# Altium project IMU V1.PrjPcb (part 2 of 2)

## Sheet GPS Connector - LS20031.SchDoc
size A4; Organization: Altium Limited; Address1: 3 Minna Close; Address2: Belrose; Address3: NSW 2085; Address4: Australia
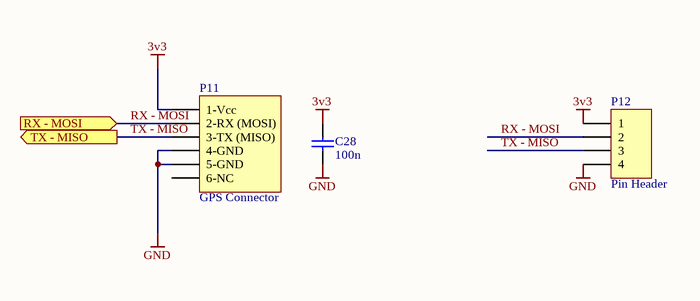
[diagram p13: GPS Connector - LS20031.SchDoc]

### Parts
C28  100n  [C0805]
P11  GPS Connector  [GPScon-BM06B-SRSS-TB]
P12  Pin Header  [PH1x4_2.54]

### Ports
RX - MOSI (in), TX - MISO (out)

### Nets
3v3: C28.2 P11.A1(1-Vcc) P12.1
GND: C28.1 P11.0 P11.A4(4-GND) P11.A5(5-GND) P12.4
RX - MOSI: P11.A2(2-RX_(MOSI)) P12.2 ; port RX - MOSI  [project net GPS - MOSI]
TX - MISO: P11.A3(3-TX_(MISO)) P12.3 ; port TX - MISO  [project net GPS - MISO]

Not connected (* = marked no-connect by the designer): P11 A6(6-NC)

### Notes on the sheet
- Title
- Size:
- Date:
- A4
- Name:
- Time:
- Ing. W. Pietersz
- Revision:
- Sheet
- of
- WillyPietersz@gmail.com
- Contact:
- -
- www.wnpd.nl
- Disclaimer
  Any design and information, hardware or software  is provided on an "as-is" basis without warranty of any kind and any express or implied warranties, including, but not limited to, the implied warranties of merchantability and fitness for a particular purpose are disclaimed. In no event shall wnpd (or KeaDrone)be liable for any direct, indirect, incidental, special, exemplary, or consequential damages (including, but not limited to, procurement of substitute goods or services; loss of use, data, or profits; or business interruption) however caused and on any theory of liability, whether in contract, strict liability, or tort (including negligence or otherwise) arising in any way out of the use of this firmware, hardware, software or information, even if wnpd (or KeaDrone) has been advised by user of the possibility of such potential loss or damage. The user agrees to hold wnpd (or KeaDrone) harmless from and against any and all claims, losses, liabilities and expenses.
- File:

### Library data of the parts
C28 = 100n: Tolerance: 0.1; LatestRevision Note: Initial Release; Part Number: 100n; Value: 100n; Package: 0805; Component Type: Standard; LatestRevision Date: 31-7-2010; Author: Willy Pietersz; Supplier 2: Farnell; Supplier Part Number 2: 1759266; ComponentLink1Description: Manufacturer; ComponentLink2Description: Datasheet
P11 = GPS-LS20031: Header, 6-Pin; GPS; 1mm pitch; SMT; SH connector; Crimp; LatestRevisionDate: 17-Jul-2002; LatestRevisionNote: Re-released for DXP Platform.; Publisher: Altium Limited; Part Number: GPS-LS20031; Number Of Pins: 6
P12 = PH1x4: Con1x4; Part Number: PH1x4; Pitch: 2.54; LatestRevision Note: Initial Release; Type: Pin Header; Number Of Pins: 4; Component Type: Standard; LatestRevision Date: 23-11-2010; Author: Willy Pietersz; Supplier 2: Farnell

## Sheet Sensor current 100A.SchDoc
size A4; Organization: Altium Limited; Address1: 3 Minna Close; Address2: Belrose; Address3: NSW 2085; Address4: Australia
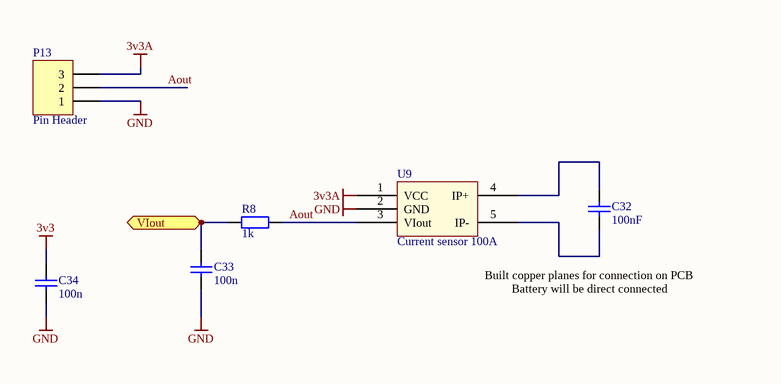
[diagram p14: Sensor current 100A.SchDoc]

### Parts
C32  100nF  [C1206]
C33  100n  [C0805]
C34  100n  [C0805]
P13  Pin Header  [PH1x3_2.54]
R8  value 1k  [R0805]  (hidden comment: RESISTOR)
U9  Current sensor 100A  [unique-ACS758xCB]

### Ports
VIout (out)

### Nets
3v3: C34.2
3v3A: P13.3 U9.1(VCC)
GND: C33.1 C34.1 P13.1 U9.2(GND)
Aout: P13.2 R8.1 U9.3(VIout)
NetC32_1: C32.1 U9.5(IP-)
NetC32_2: C32.2 U9.4(IP+)
NetC33_2: C33.2 R8.2 ; port VIout

### Notes on the sheet
- Built copper planes for connection on PCB
- Battery will be direct connected
- Title
- Size:
- Date:
- A4
- Name:
- Time:
- Ing. W. Pietersz
- Revision:
- Sheet
- of
- WillyPietersz@gmail.com
- Contact:
- info@unique-system.nl
- Unique System Elektronics
- Biesboschhaven noord 1-b
- 4251 NL Werkendam
- Netherlands
- www.unique-system.nl
- File:

### Library data of the parts
C32 = 0.1uF: Part Number: 0.1uF; Value: 0.1uF; Voltage: 50V; Type: Ceramic; Tolerance: 0.1; LatestRevision Note: Initial Release; Package: 1206; Component Type: Standard; LatestRevision Date: 14-9-2010; Author: Willem Pietersz; Supplier 2: Farnell; Supplier Part Number 2: 1759361; ComponentLink1Description: Manufacturer; ComponentLink2Description: Datasheet
C33 C34 = 100n: as C28 on sheet GPS Connector - LS20031; Part Number: 100n; Value: 100n; Package: 0805; Component Type: Standard; LatestRevision Date: 31-7-2010; Author: Willy Pietersz; Supplier 2: Farnell; Supplier Part Number 2: 1759266; ComponentLink1Description: Manufacturer; ComponentLink2Description: Datasheet
P13 = PH1x3: Con1x3; Part Number: PH1x3; Pitch: 2.54; LatestRevision Note: Initial Release; Type: Pin Header; Number Of Pins: 3; Component Type: Standard; LatestRevision Date: 23-11-2010; Author: Willy Pietersz; Supplier 2: Farnell
R8 = 1K: Manufacturer 1: Panasonic; Manufacturer 1 Part No: ERJT06J102V; Power: 0.25W; Tolerance: 0.05; LatestRevision Note: Initial Release; Published: 8-Jun-2000; LatestRevisionDate: 17-Jul-2002; LatestRevisionNote: Re-released for DXP Platform.; PackageReference: AXIAL-0.4; Publisher: Altium Limited; Part Number: 1K; Type: Film; Package: 0805; Component Type: Standard; LatestRevision Date: 30-7-2010; Author: Willy Pietersz; ROHS: Y; Supplier 2: Farnell; Supplier Part Number 2: 1618241; ComponentLink1Description: Manufacturer; ComponentLink2Description: Datasheet
U9 = ACS758xCB: Sensor, Current; Part Number: ACS758xCB; Component Type: Sensor; Supplier 1: Digikey; Supplier Part Number 1: 620-1321-ND; Supplier 2: Farnell; Supplier Part Number 2: 1791393; ComponentLink1Description: Datasheet; ComponentLink1URL: http://www.allegromicro.com/en/Products/Part_Numbers/0758/0758.pdf

## Sheet JTAG Connector.SchDoc: JTAG Interface
size A4; Organization: Altium Limited; Address1: 3 Minna Close; Address2: Belrose; Address3: NSW 2085; Address4: Australia
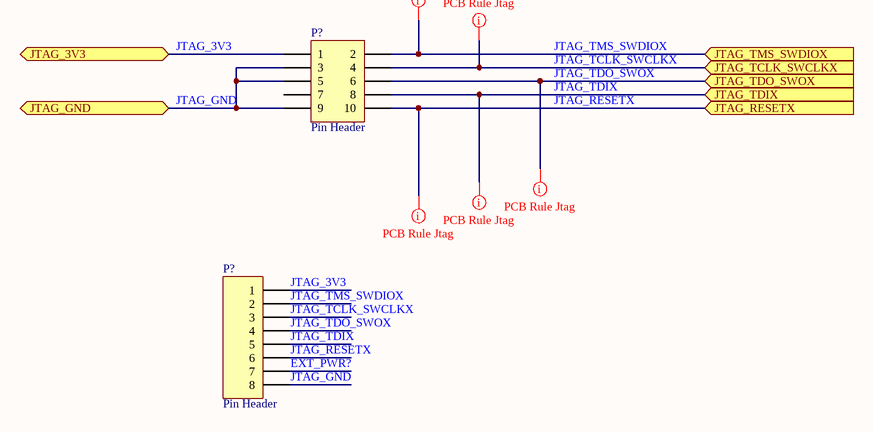
[diagram p15: JTAG Connector.SchDoc]

### Parts
(Parts that share a designator on the sheet are numbered #1, #2 ... from top to bottom, then left to right.)
P?#6  Pin Header  [PH2x5_2.54]
P?#7  Pin Header  [PH1x8_2.54]

### Ports
JTAG_3V3, JTAG_GND, JTAG_RESETX (in), JTAG_TCLK_SWCLKX (in), JTAG_TDIX (in), JTAG_TDO_SWOX (in), JTAG_TMS_SWDIOX (in)

### Nets
EXT_PWR?: P?#7.7
JTAG_3V3: P?#6.1 P?#7.1 ; port JTAG_3V3
JTAG_GND: P?#6.3 P?#6.5 P?#6.9 P?#7.8 ; port JTAG_GND
JTAG_RESETX: P?#6.10 P?#7.6 ; port JTAG_RESETX
JTAG_TCLK_SWCLKX: P?#6.4 P?#7.3 ; port JTAG_TCLK_SWCLKX
JTAG_TDIX: P?#6.8 P?#7.5 ; port JTAG_TDIX
JTAG_TDO_SWOX: P?#6.6 P?#7.4 ; port JTAG_TDO_SWOX
JTAG_TMS_SWDIOX: P?#6.2 P?#7.2 ; port JTAG_TMS_SWDIOX

Not connected (* = marked no-connect by the designer): P?#6 7

### Layout directives
rule Fabrication Testpoint Style [Under Comp - Don't Allow    Sides - Top,    Pref Size = 1.5mm    Pref Hole Size = 0.8128mm    Using Grid = Yes    Grid = 0.0254mm    Grid Tolerance = 0.00025mm]; rule Routing Priority [Priority = 99]: JTAG_RESETX, JTAG_TCLK_SWCLKX, JTAG_TDIX, JTAG_TDO_SWOX, JTAG_TMS_SWDIOX

### Notes on the sheet
- Disclaimer
  Any design and information, hardware or software  is provided on an "as-is" basis without warranty of any kind and any express or implied warranties, including, but not limited to, the implied warranties of merchantability and fitness for a particular purpose are disclaimed. In no event shall wnpd (or KeaDrone)be liable for any direct, indirect, incidental, special, exemplary, or consequential damages (including, but not limited to, procurement of substitute goods or services; loss of use, data, or profits; or business interruption) however caused and on any theory of liability, whether in contract, strict liability, or tort (including negligence or otherwise) arising in any way out of the use of this firmware, hardware, software or information, even if wnpd (or KeaDrone) has been advised by user of the possibility of such potential loss or damage. The user agrees to hold wnpd (or KeaDrone) harmless from and against any and all claims, losses, liabilities and expenses.
- Title
- Size:
- Date:
- A4
- Name:
- Time:
- Ing. W. Pietersz
- Revision:
- Sheet
- of
- WillyPietersz@gmail.com
- Contact:
- -
- www.wnpd.nl
- File:

### Library data of the parts
P?#6 = PH2x5: Header, 5-Pin, Dual row; Part Number: PH2x5; Pitch: 2.54; LatestRevision Note: Initial Release; Type: Pin Header; Number Of Pins: 10; Component Type: Standard; LatestRevision Date: 23-11-2010; Author: Willy Pietersz; Supplier 2: Farnell
P?#7 = PH1x8: Con1x8; Part Number: PH1x8; Pitch: 2.54; LatestRevision Note: Initial Release; Type: Pin Header; Number Of Pins: 8; Component Type: Standard; LatestRevision Date: 23-11-2010; Author: Willy Pietersz; Supplier 2: Farnell

## Nets that join several sheets
3v3: Accelerometer 3-AXIS - BMA180 (C?#2.2 P?#1.1 U?#1.10), GYRO 3-AXIS - ITG-3200 (7 pins), Pressure sensor - SCP1000-D01 (C?#4.2 P?#2.1 U?#2.5), Temperature sensor - TC1046VNBTR (P9.1 U6.1), U_Subsheets combined/PSU 3v3 (C30A.2 C31A.2 U8A.3), GPS Connector - LS20031 (C28.2 P11.A1 P12.1), Sensor current 100A (C34.2)
3v3-zigbee: Zigbee interface (P7.1 U5.1), U_Subsheets combined/U_Zigbee interface/PSU 3v3-xBee (C30C.2 C31C.2 U8C.3)
3v3A: Accelerometer 3-AXIS - BMA180 (C?#1.2 U?#1.2), Pressure sensor - SCP1000-D01 (C?#3.1 U?#2.13), U_Subsheets combined/PSU 3v3A (C30B.2 C31B.2 U8B.3), Sensor current 100A (P13.3 U9.1)
5v0: SMPS 1000mA - LM22672 (5 pins), U_Subsheets combined/PSU 3v3 (C29A.2 U8A.2), U_Subsheets combined/PSU 3v3A (C29B.2 U8B.2), U_Subsheets combined/U_Zigbee interface/PSU 3v3-xBee (C29C.2 U8C.2), U_Subsheets combined/ServoConnector1 (P4A.2 R6A.2), U_Subsheets combined/ServoConnector2 (P4B.2 R6B.2), U_Subsheets combined/ServoConnector3 (P4C.2 R6C.2), U_Subsheets combined/ServoConnector4 (P4D.2 R6D.2), U_Subsheets combined/ServoConnector5 (P4E.2 R6E.2), U_Subsheets combined/ServoConnector6 (P4F.2 R6F.2), LV-MaxSonar Connector (C?#11.2 P?#5.2)
GND: Subsheets combined (R7.2), GYRO 3-AXIS - ITG-3200 (9 pins), Pressure sensor - SCP1000-D01 (C?#4.1 C?#5.2 P?#2.8 U?#2.6), Temperature sensor - TC1046VNBTR (C27.1 P9.3 U6.3), SMPS 1000mA - LM22672 (11 pins), U_Subsheets combined/PSU 3v3 (C29A.1 C30A.1 C31A.1 U8A.1), Power Entry 24v-3pin Fused-1A5 (P5.1), Zigbee interface (P7.5 U5.10), U_Subsheets combined/U_Zigbee interface/PSU 3v3-xBee (C29C.1 C30C.1 C31C.1 U8C.1), U_Subsheets combined/ServoConnector1 (P4A.1), U_Subsheets combined/ServoConnector2 (P4B.1), U_Subsheets combined/ServoConnector3 (P4C.1), U_Subsheets combined/ServoConnector4 (P4D.1), U_Subsheets combined/ServoConnector5 (P4E.1), U_Subsheets combined/ServoConnector6 (P4F.1), LV-MaxSonar Connector (C?#11.1 P?#5.1), Battery Voltage 12v Max (C3.1 R2.2), GPS Connector - LS20031 (5 pins), Sensor current 100A (C33.1 C34.1 P13.1 U9.2)
GNDA: Subsheets combined (R7.1), Accelerometer 3-AXIS - BMA180 (C?#1.1 C?#2.1 P?#1.7 U?#1.3), Pressure sensor - SCP1000-D01 (7 pins), U_Subsheets combined/PSU 3v3A (C29B.1 C30B.1 C31B.1 U8B.1)
Input 11.1v: SMPS 1000mA - LM22672 (C?#7.2 C?#8.2 P?#3.2 U?#3.7), Power Entry 24v-3pin Fused-1A5 (D1.2), Battery Voltage 12v Max (R1.1)
SCK: Accelerometer 3-AXIS - BMA180 (P?#1.4 U?#1.7), Pressure sensor - SCP1000-D01 (P?#2.2 U?#2.9)
SPI MISO: Accelerometer 3-AXIS - BMA180 (P?#1.3 U?#1.8), Pressure sensor - SCP1000-D01 (P?#2.3 U?#2.11)
SPI MOSI: Accelerometer 3-AXIS - BMA180 (P?#1.2 U?#1.9), Pressure sensor - SCP1000-D01 (P?#2.4 U?#2.10)